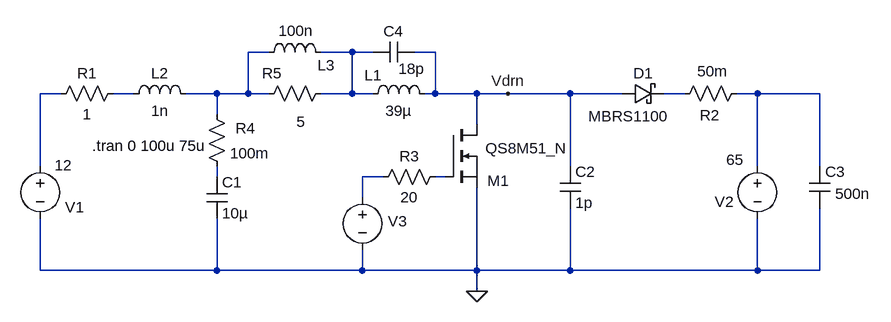
[diagram p0: schematic BMS_Charger.asc]
BMS_Charger.asc, the LTspice schematic file:
Version 4
SHEET 1 1652 680
WIRE 512 -176 480 -176
WIRE 640 -176 592 -176
WIRE 672 -176 640 -176
WIRE 768 -176 736 -176
WIRE 192 -112 160 -112
WIRE 304 -112 272 -112
WIRE 432 -112 384 -112
WIRE 480 -112 480 -176
WIRE 480 -112 432 -112
WIRE 512 -112 480 -112
WIRE 640 -112 640 -176
WIRE 640 -112 592 -112
WIRE 672 -112 640 -112
WIRE 768 -112 768 -176
WIRE 768 -112 752 -112
WIRE 832 -112 768 -112
WIRE 880 -112 832 -112
WIRE 976 -112 880 -112
WIRE 1056 -112 976 -112
WIRE 1152 -112 1120 -112
WIRE 1264 -112 1232 -112
WIRE 1360 -112 1264 -112
WIRE 432 -80 432 -112
WIRE 832 -64 832 -112
WIRE 160 0 160 -112
WIRE 976 0 976 -112
WIRE 1264 0 1264 -112
WIRE 1360 0 1360 -112
WIRE 432 16 432 0
WIRE 688 16 656 16
WIRE 784 16 768 16
WIRE 656 48 656 16
WIRE 160 160 160 80
WIRE 432 160 432 80
WIRE 432 160 160 160
WIRE 656 160 656 128
WIRE 656 160 432 160
WIRE 832 160 832 32
WIRE 832 160 656 160
WIRE 976 160 976 64
WIRE 976 160 832 160
WIRE 1264 160 1264 80
WIRE 1264 160 976 160
WIRE 1360 160 1360 64
WIRE 1360 160 1264 160
WIRE 832 192 832 160
FLAG 832 192 0
FLAG 880 -112 Vdrn
SYMBOL ind 656 -96 R270
WINDOW 0 29 17 VTop 2
WINDOW 3 5 56 VBottom 2
SYMATTR InstName L1
SYMATTR Value 39µ
SYMATTR SpiceLine Rser=0.25
SYMBOL nmos 784 -64 R0
WINDOW 0 64 86 Left 2
WINDOW 3 61 36 Left 2
SYMATTR InstName M1
SYMATTR Value QS8M51_N
SYMBOL schottky 1056 -96 R270
WINDOW 0 32 32 VTop 2
WINDOW 3 -3 9 VBottom 2
SYMATTR InstName D1
SYMATTR Value MBRS1100
SYMATTR Description Diode
SYMATTR Type diode
SYMBOL voltage 160 -16 R0
WINDOW 0 38 79 Left 2
WINDOW 3 22 14 Left 2
WINDOW 123 0 0 Left 0
WINDOW 39 0 0 Left 0
SYMATTR InstName V1
SYMATTR Value 12
SYMBOL voltage 1264 -16 R0
WINDOW 0 -66 70 Left 2
WINDOW 3 -48 6 Left 2
WINDOW 123 0 0 Left 0
WINDOW 39 24 124 Left 2
SYMATTR InstName V2
SYMATTR Value 65
SYMBOL voltage 656 32 R0
WINDOW 0 39 52 Left 2
WINDOW 3 24 96 Invisible 2
WINDOW 123 0 0 Left 0
WINDOW 39 0 0 Left 0
SYMATTR InstName V3
SYMATTR Value PULSE(0 5 0 20n 20n 3.5u 5u)
SYMBOL res 176 -96 R270
WINDOW 0 32 56 VTop 2
WINDOW 3 0 56 VBottom 2
SYMATTR InstName R1
SYMATTR Value 1
SYMBOL res 1136 -96 R270
WINDOW 0 -33 55 VTop 2
WINDOW 3 66 59 VBottom 2
SYMATTR InstName R2
SYMATTR Value 50m
SYMBOL res 672 32 R270
WINDOW 0 32 56 VTop 2
WINDOW 3 0 56 VBottom 2
SYMATTR InstName R3
SYMATTR Value 20
SYMBOL ind 288 -96 R270
WINDOW 0 32 56 VTop 2
WINDOW 3 5 56 VBottom 2
SYMATTR InstName L2
SYMATTR Value 1n
SYMATTR SpiceLine Ipk=5 Rser=0.1
SYMBOL cap 416 16 R0
SYMATTR InstName C1
SYMATTR Value 10µ
SYMBOL res 416 -96 R0
WINDOW 0 45 37 Left 2
SYMATTR InstName R4
SYMATTR Value 100m
SYMBOL cap 960 0 R0
SYMATTR InstName C2
SYMATTR Value 1p
SYMBOL cap 1344 0 R0
WINDOW 3 40 42 Left 2
SYMATTR InstName C3
SYMATTR Value 500n
SYMBOL cap 736 -192 R90
WINDOW 0 0 32 VBottom 2
WINDOW 3 26 4 VTop 2
SYMATTR InstName C4
SYMATTR Value 18p
SYMBOL ind 496 -160 R270
WINDOW 0 -20 104 VTop 2
WINDOW 3 64 58 VBottom 2
SYMATTR InstName L3
SYMATTR Value 100n
SYMBOL res 496 -96 R270
WINDOW 0 32 21 VTop 2
WINDOW 3 -12 65 VBottom 2
SYMATTR InstName R5
SYMATTR Value 5
TEXT 240 -32 Left 2 !.tran 0 100u 75u

The netlist it stands for:
* BMS_Charger.asc
L1 N002 Vdrn 39µ Rser=0.25
M1 Vdrn N009 0 0 QS8M51_N
D1 Vdrn N005 MBRS1100
V1 N003 0 12
V2 N006 0 65
V3 N008 0 PULSE(0 5 0 20n 20n 3.5u 5u)
R1 N003 N004 1
R2 N005 N006 50m
R3 N008 N009 20
L2 N004 N001 1n Ipk=5 Rser=0.1
C1 N007 0 10µ
R4 N001 N007 100m
C2 Vdrn 0 1p
C3 N006 0 500n
C4 Vdrn N002 18p
L3 N001 N002 100n
R5 N001 N002 5
.model D D
.lib standard.dio
.model NMOS NMOS
.model PMOS PMOS
.lib standard.mos
.tran 0 100u 75u
.backanno
.end